# EAGLE design Layout_Controller_Chris (EAGLE 4.16)
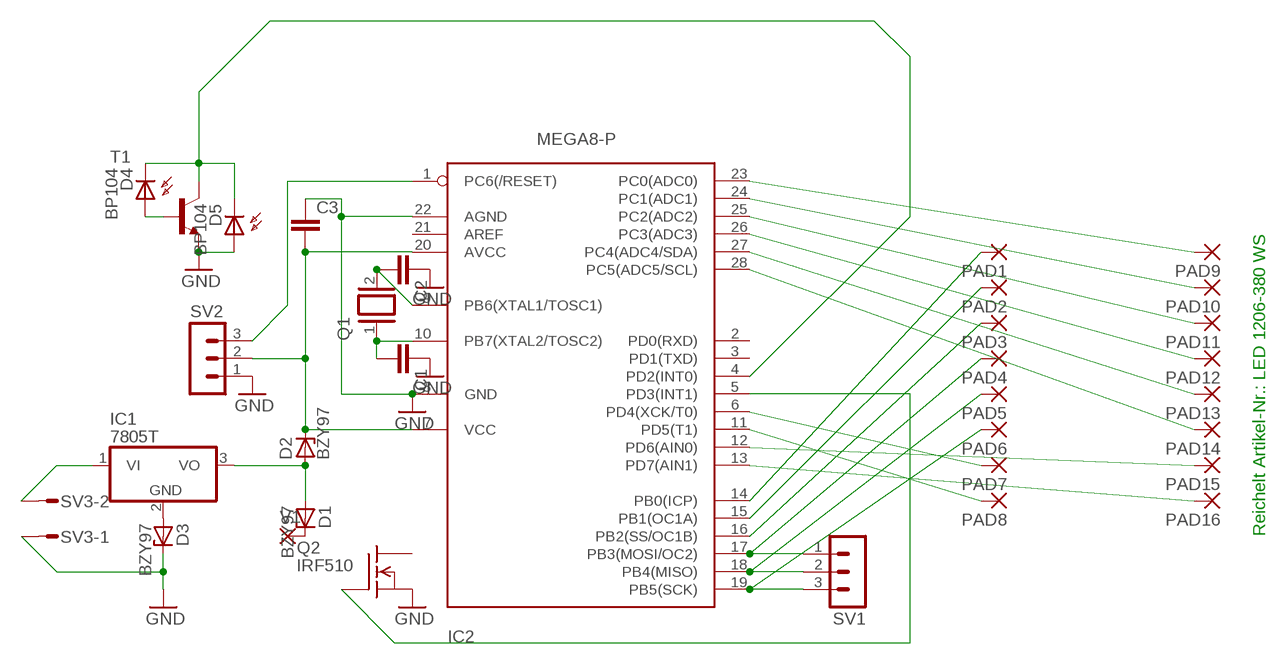
[diagram p0: schematic, sheet 1]

## Parts
C1  C-EUC1206  [C1206]
C2  C-EUC1206K  [C1206K]
C3  C-EUC1206K  [C1206K]
D1  BZY97  [F126Z12]
D2  BZY97  [F126Z12]
D3  BZY97  [F126Z12]
D4  BP104  [BP104]
D5  BP104  [BP104]
IC1  7805T  [TO220H]
IC2  MEGA8-P  [DIL28-3]
PAD1  3,81/1,1  [3,81/1,1]
PAD2  3,81/1,1  [3,81/1,1]
PAD3  3,81/1,1  [3,81/1,1]
PAD4  3,81/1,1  [3,81/1,1]
PAD5  3,81/1,1  [3,81/1,1]
PAD6  3,81/1,1  [3,81/1,1]
PAD7  3,81/1,1  [3,81/1,1]
PAD8  3,81/1,1  [3,81/1,1]
PAD9  3,81/1,1  [3,81/1,1]
PAD10  3,81/1,1  [3,81/1,1]
PAD11  3,81/1,1  [3,81/1,1]
PAD12  3,81/1,1  [3,81/1,1]
PAD13  3,81/1,1  [3,81/1,1]
PAD14  3,81/1,1  [3,81/1,1]
PAD15  3,81/1,1  [3,81/1,1]
PAD16  3,81/1,1  [3,81/1,1]
Q1  XTAL/S  [QS]
Q2  IRF510  [TO220]
SV1  MA03-1  [MA03-1]
SV2  MA03-1  [MA03-1]
SV3  L02P  [L02P]
T1  BC550B-NPN-TO92-EBC  [TO92-EBC]
V1  3,81/1,1  [3,81/1,1]

## Nets
GND: C1.1 C2.1 C3.1 D3.C D5.A IC2.8(GND) IC2.22(AGND) Q2.3(S) SV2.1 SV3.1 T1.E
N$1: IC2.14(PB0(ICP)) PAD1.1(P)
N$2: IC2.15(PB1(OC1A)) PAD2.1(P)
N$3: IC2.16(PB2(SS/OC1B)) PAD3.1(P)
N$4: IC2.17(PB3(MOSI/OC2)) PAD4.1(P) SV1.1
N$5: D4.A T1.B
N$6: D1.C V1.1(P)
N$7: IC2.18(PB4(MISO)) PAD5.1(P) SV1.2
N$8: IC2.19(PB5(SCK)) PAD6.1(P) SV1.3
N$9: C3.2 D2.C IC2.7(VCC) IC2.20(AVCC) SV2.2
N$10: D1.A D2.A IC1.3(VO)
N$11: IC2.23(PC0(ADC0)) PAD9.1(P)
N$12: IC2.24(PC1(ADC1)) PAD10.1(P)
N$13: IC2.25(PC2(ADC2)) PAD11.1(P)
N$14: IC2.26(PC3(ADC3)) PAD12.1(P)
N$15: IC2.27(PC4(ADC4/SDA)) PAD13.1(P)
N$16: IC2.28(PC5(ADC5/SCL)) PAD14.1(P)
N$17: IC2.6(PD4(XCK/T0)) PAD7.1(P)
N$19: IC2.11(PD5(T1)) PAD8.1(P)
N$20: IC2.12(PD6(AIN0)) PAD15.1(P)
N$21: IC2.13(PD7(AIN1)) PAD16.1(P)
N$22: D3.A IC1.2(GND)
N$23: D4.K(C) D5.K(C) IC2.4(PD2(INT0)) T1.C
N$24: IC2.1(PC6(/RESET)) SV2.3
N$25: C2.2 IC2.9(PB6(XTAL1/TOSC1)) Q1.2
N$26: C1.2 IC2.10(PB7(XTAL2/TOSC2)) Q1.1
N$27: IC1.1(VI) SV3.2
N$40: IC2.5(PD3(INT1)) Q2.1(G)
Unconnected: IC2.2(PD0(RXD)) IC2.3(PD1(TXD)) IC2.21(AREF) Q2.2(D)

## Notes on the sheet
- Reichelt Artikel-Nr.: LED 1206-380 WS

## Library data of the parts
C1-C3 = rcl:C-EU: CAPACITOR, European symbol
D1-D3 = diode:BZY97: Z DIODE
D4 D5 = opto-trans-siemens:BP104: PHOTO DIODE
IC1 = linear:78*: Positive VOLTAGE REGULATOR Source: http://cache.national.com/ds/LM/LM78L05.pdf http://www.fairchildsemi.com/ds/LM/LM7805.pdf
IC2 = atmel:MEGA8-P: MICROCONTROLLER 8 Kbytes FLASH 1 kbytes SRAM 512 bytes EEPROM USART 4-channel 10 bit ADC 2-channel 8 bit ADC Source: avr.lbr
PAD1-PAD16 V1 = wirepad:3,81/1,1: THROUGH-HOLE PAD
Q1 = special:XTAL/S: CRYSTAL
Q2 = transistor-fet:IRF510: N-Channel Enhancement MOSFET (HEXFET); 100V; 5,6A; 0,54Ohm
SV1 SV2 = con-lstb:MA03-1: PIN HEADER
SV3 = con-amp-mt:L02P: AMP MT CONNECTOR
T1 = transistor:*-NPN-: NPN Transistror

## Board
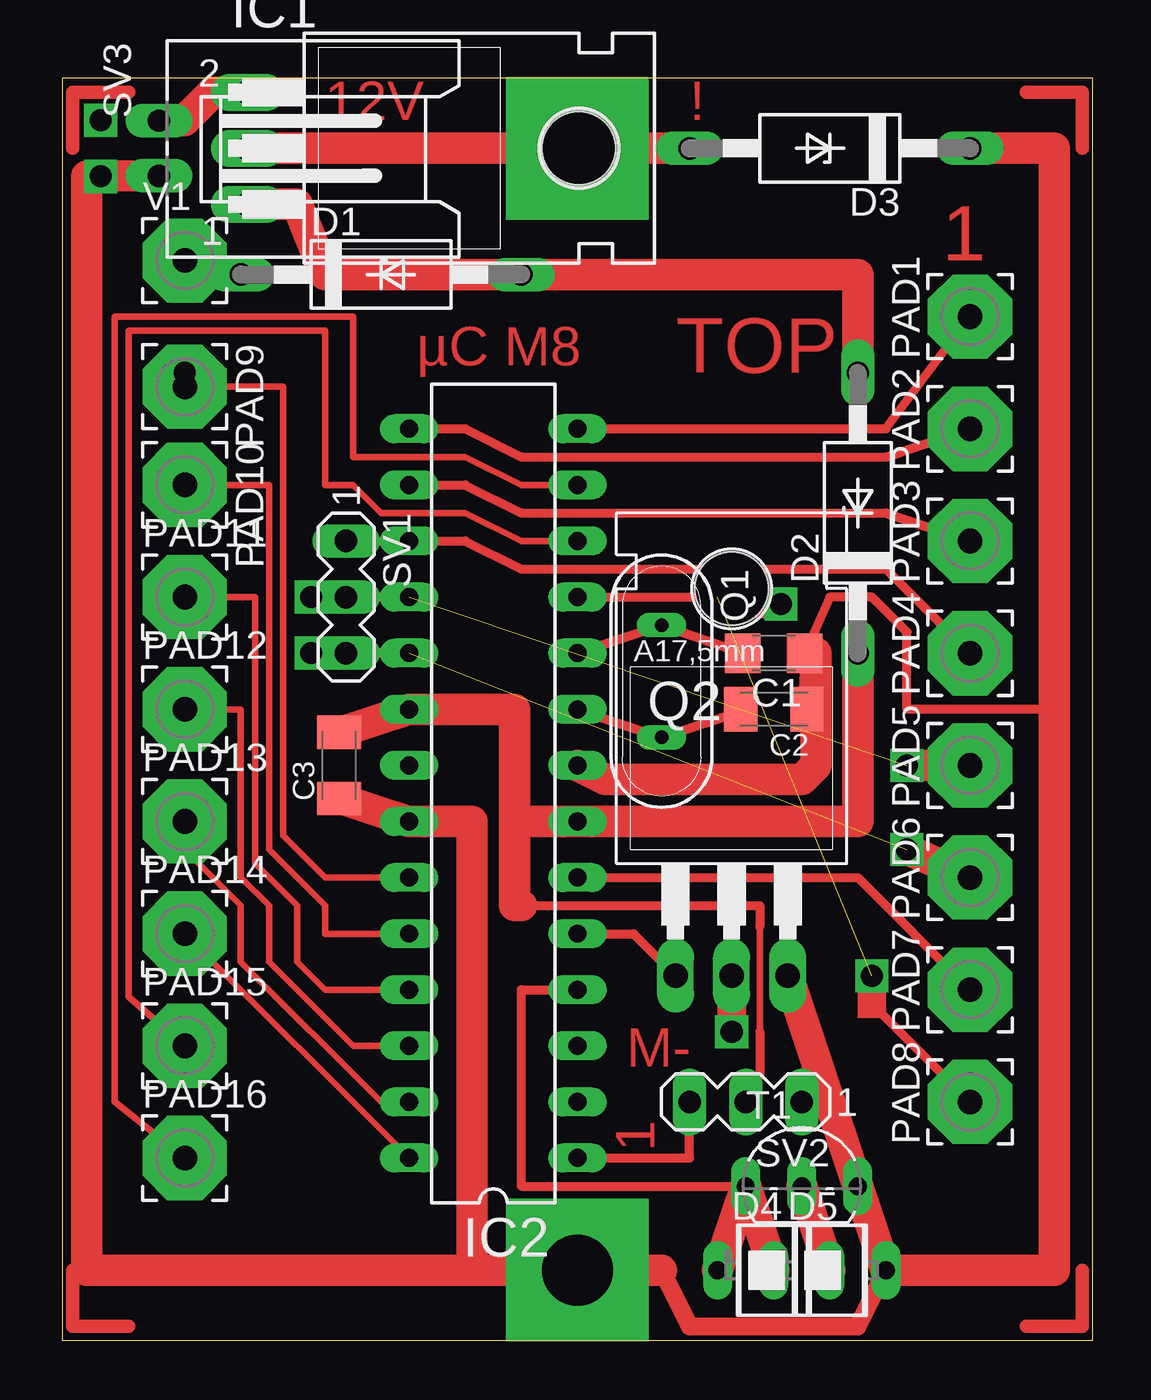
[diagram p1: board, top side]

Size 46.66 x 57.14 mm. Coordinates in mm from the lower left corner, seen from the top.
Outline: 0,0 46.66,0 46.66,57.14 0,57.14 0,0
Copper layers (1*16): Top 0.035mm / dielectric 1.5mm / Bottom 0.035mm
Design rules "default": minimum track width 10mil, minimum drill 24mil, track to track 8mil, track to pad 8mil, pad to pad 8mil, via to via 8mil, smd to smd 8mil, copper to edge 40mil, drill to drill 8mil, minimum pad ring 10mil, minimum via ring 8mil, stop-mask expansion 4mil, vias tented up to drill 0mil, thermal gap 10mil

### Footprints (pad centres in the part's own frame; a part is rotated, then mirrored left to right if it is on the bottom)
C1206 = smd 1.6 x 1.8: 1 -1.4,0; 2 1.4,0
C1206K = smd 1.5 x 2: 1 -1.5,0; 2 1.5,0
F126Z12 = drill 1.016 long: A 6.35,0; C -6.35,0
BP104 = drill 0.813 long: A 0,2.54; K 0,-2.54
TO220H = drill 1.118 long: 1 -2.54,-10.16; 2 0,-10.16; 3 2.54,-10.16 | hole 3.302: 0,4.826
DIL28-3 = drill 0.813 long: 1 -16.51,-3.81; 2 -13.97,-3.81; 3 -11.43,-3.81; 4 -8.89,-3.81; 5 -6.35,-3.81; 6 -3.81,-3.81; 7 -1.27,-3.81; 8 1.27,-3.81; 9 3.81,-3.81; 10 6.35,-3.81; 11 8.89,-3.81; 12 11.43,-3.81; 13 13.97,-3.81; 14 16.51,-3.81; 15 16.51,3.81; 16 13.97,3.81; 17 11.43,3.81; 18 8.89,3.81; 19 6.35,3.81; 20 3.81,3.81; 21 1.27,3.81; 22 -1.27,3.81; 23 -3.81,3.81; 24 -6.35,3.81; 25 -8.89,3.81; 26 -11.43,3.81; 27 -13.97,3.81; 28 -16.51,3.81
3,81/1,1 = drill 1.118 pad 3.81 octagon: 1 0,0
QS = drill 0.61 long: 1 -2.54,0; 2 2.54,0
TO220 = drill 1.118 long: 1 -2.54,-6.35; 2 0,-6.35; 3 2.54,-6.35 | hole 3.302: 0,11.176
MA03-1 = drill 1.016 long: 1 -2.54,0; 2 0,0; 3 2.54,0
L02P = drill 1.016 long: 1 1.25,-6.25; 2 -1.25,-6.25
TO92-EBC = drill 0.813 long: B 0,-1.27; C -2.54,-1.27; E 2.54,-1.27

### Placement (x,y rotation side)
C1  32.22,31.11 180 top
C2  32.22,28.57 180 top
C3  12.54,26.03 90 top
D1  14.44,48.26 0 top
D2  36.03,37.46 90 top
D3  34.76,53.97 180 top
D4  32.22,3.17 270 top
D5  34.76,3.17 270 top
IC1  18.57,53.97 270 top
IC2  19.52,24.76 90 top
PAD1  41.11,46.35 90 top
PAD2  41.11,41.27 90 top
PAD3  41.11,36.19 90 top
PAD4  41.11,31.11 90 top
PAD5  41.11,26.03 90 top
PAD6  41.11,20.95 90 top
PAD7  41.11,15.87 90 top
PAD8  41.11,10.79 90 top
PAD9  5.55,43.17 270 top
PAD10  5.55,38.73 270 top
PAD11  5.55,33.65 0 top
PAD12  5.55,28.57 0 top
PAD13  5.55,23.49 0 top
PAD14  5.55,18.41 0 top
PAD15  5.55,13.33 0 top
PAD16  5.55,8.25 0 top
Q1  27.14,29.84 270 top
Q2  30.32,22.86 0 top
SV1  12.85,33.65 270 top
SV2  30.95,10.79 180 top
SV3  10.63,53.97 270 top
T1  33.49,8.25 0 top
V1  5.55,48.89 0 top

### Tracks (layer width: path | path; a pad name or v marks a point on that pad's centre or on a via)
GND
  Top 0.406: 44.92,28.57 38.25,28.57 38.25,32.06 36.67,33.65 34.76,33.65 C1.1 33.49,28.57 C2.1
  Top 0.813: 27.14,3.17 28.41,0.63 36.03,0.63 D5.A
  Top 1.422: D3.C 44.92,53.97 44.92,28.57 44.92,3.17 D5.A T1.E 34.76,10.79 | 34.76,10.79 SV2.1 | SV3.1 1.11,52.7 1.11,3.17 18.57,3.17 | 18.57,3.17 27.14,3.17 | 18.57,3.17 18.57,23.49 IC2.22 C3.1 | IC2.8 24.6,25.39 33.49,25.39 34.12,26.03 34.12,31.11 C1.1 | 34.76,10.79 Q2.3
N$1
  Top 0.406: IC2.14 37.3,41.27 PAD1.1
N$2
  Top 0.406: IC2.15 18.25,41.27 20.79,40 37.3,40 PAD2.1
N$3
  Top 0.406: IC2.16 18.25,38.73 20.79,37.46 37.3,37.46 PAD3.1
N$4
  Top 0.406: SV1.1 IC2.17 18.25,36.19 20.79,34.92 37.3,34.92 PAD4.1
N$5
  Top 1.422: D4.A T1.B
N$6
  Top 1.422: V1.1 D1.C
N$7  (1 unrouted)
  Top 0.406: SV1.2 IC2.18 11.27,33.65
  Top 1.422: 38.25,26.03 PAD5.1
N$8  (via drill 1)  (1 unrouted)
  Top 0.406: SV1.3 IC2.19 11.27,31.11
  Top 1.422: PAD6.1 v38.25,22.22
N$9
  Top 0.305: 31.58,18.73 31.58,13.96
  Top 0.406: 20.79,19.68 31.58,19.68 31.58,18.73 | SV2.2 31.58,12.06 31.58,13.96
  Top 1.422: D2.C 36.03,23.49 IC2.7 20.47,23.49 | 20.47,23.49 20.47,28.57 IC2.20 C3.2 | 20.47,23.49 20.47,19.68 20.79,19.68
N$10
  Top 1.422: IC1.3 10.63,51.43 11.9,48.26 D1.A 36.03,48.26 D2.A
N$11  (via drill 1)
  Top 0.305: PAD9.1 10,43.17 10,22.86 11.9,20.95 IC2.23
  Top 0.406: PAD9.1 v5.55,43.81
N$12
  Top 0.305: PAD10.1 9.36,38.73 9.36,22.22 11.9,19.68 11.9,18.41 IC2.24
N$13
  Top 0.305: PAD11.1 8.72,33.65 8.72,21.59 10.63,19.68 10.63,17.14 11.9,15.87 IC2.25
N$14
  Top 0.305: PAD12.1 8.09,28.57 8.09,20.95 9.36,19.68 9.36,17.14 13.17,13.33 IC2.26
N$15
  Top 0.305: PAD13.1 5.55,22.22 8.09,19.68 8.09,17.14 14.44,10.79 IC2.27
N$16
  Top 0.305: PAD14.1 IC2.28
N$17
  Top 0.406: IC2.6 36.03,20.95 PAD7.1
N$18  (via drill 3.2 pad 6.45)
  other vias: 23.33,53.97
N$19  (1 unrouted)
  Top 0.406: IC2.11 29.68,33.65 | PAD8.1 36.67,15.23 36.67,16.5
N$20
  Top 0.305: IC2.12 20.79,36.19 18.25,37.46 14.44,37.46 13.17,38.73 11.9,38.73 11.9,45.72 3.01,45.72 3.01,15.55 PAD15.1
N$21
  Top 0.305: IC2.13 20.79,38.73 18.25,40 13.17,40 13.17,46.35 2.38,46.35 2.38,10.79 PAD16.1
N$22
  Top 1.422: IC1.2 D3.A
N$23
  Top 0.406: T1.C 20.79,6.98 20.79,15.87 IC2.4
  Top 1.422: D5.K T1.C D4.K
N$24
  Top 0.406: IC2.1 28.41,8.25 SV2.3
N$25
  Top 0.406: IC2.9 Q1.2 30.95,28.57 C2.2
N$26
  Top 0.406: C1.2 Q1.1 IC2.10
N$27
  Top 1.422: SV3.2 5.53,55.22 6.82,56.51 IC1.1
N$28  (via drill 1)
  other vias: 11.27,33.65
N$29  (via drill 1)
  other vias: 11.27,31.11
N$30  (via drill 1)
  other vias: 38.25,26.03
N$31  (via drill 1)
  other vias: 32.54,33.33
N$32  (via drill 1)
  other vias: 36.67,16.5
N$33  (via drill 1)
  other vias: 1.74,55.24
N$34  (via drill 1)
  other vias: 1.74,52.7
N$35  (via drill 3.2 pad 6.45)
  other vias: 23.33,3.17
N$36
  Top 0.61: 0.47,53.97 0.47,56.51 3.01,56.51
N$37
  Top 0.61: 0.47,3.17 0.47,0.63 3.01,0.63
N$38
  Top 0.61: 43.65,0.63 46.19,0.63 46.19,3.17
N$39
  Top 0.61: 43.65,56.51 46.19,56.51 46.19,53.97
N$40
  Top 0.406: IC2.5 25.87,18.41 Q2.1
N$41  (via drill 1)
  other vias: 30.32,13.96
(copper drawn outside any net)
  shapes: Top area x5

### Text on the board
Top: 12V | ! | 1 | µC M8 | TOP | M- | 1